# EAGLE design buttonbox (EAGLE 7.6.0)
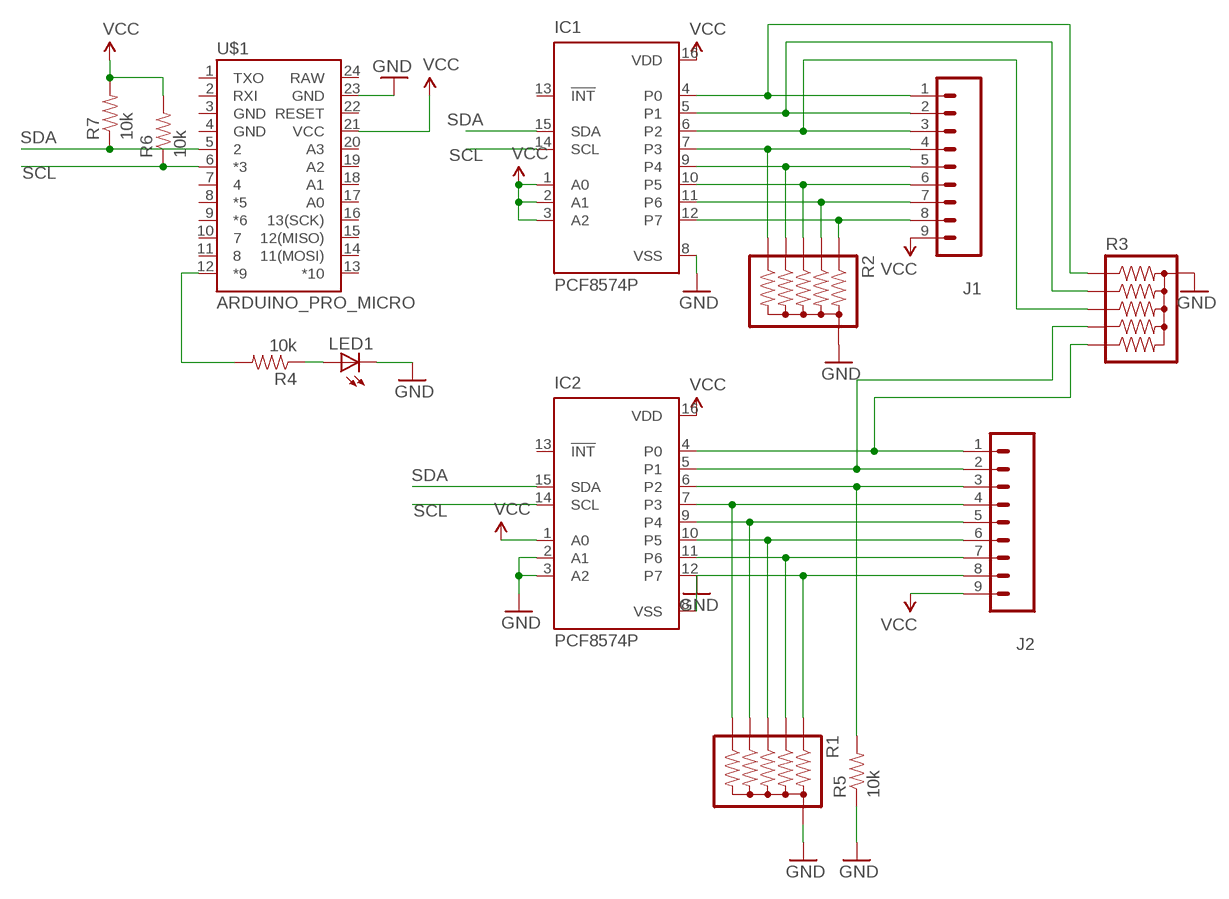
[diagram p0: schematic, sheet 1]

## Parts
IC1  PCF8574P  [DIL16]
IC2  PCF8574P  [DIL16]
J1  M09LONGPADS  [1X09_LONGPADS]
J2  M09LONGPADS  [1X09_LONGPADS]
LED1  LED5MM  [LED5MM]
R1  RPACK-BUSSED-5-SIP-PTH-5  [RPACK-SIP-PTH-5]
R2  RPACK-BUSSED-5-SIP-PTH-5  [RPACK-SIP-PTH-5]
R3  RPACK-BUSSED-5-SIP-PTH-5  [RPACK-SIP-PTH-5]
R4  10k  10KOHM-1/4W-1%(PTH)HORIZ  [AXIAL-0.3]
R5  10k  10KOHM-1/4W-1%(PTH)HORIZ  [AXIAL-0.3]
R6  10k  10KOHM-1/4W-1%(PTH)HORIZ  [AXIAL-0.3]
R7  10k  10KOHM-1/4W-1%(PTH)HORIZ  [AXIAL-0.3]
U$1  ARDUINO_PRO_MICRO  [ARDUINO_PRO_MICRO]

## Nets
GND: IC1.8(VSS) IC2.2(A1) IC2.3(A2) IC2.8(VSS) LED1.K(C) R1.P$1 R2.P$1 R3.P$1 R5.P$1 U$1.23(GND)
N$1: LED1.A R4.P$1
N$2: IC2.5(P1) J2.2 R3.P$5
N$5: R4.P$2 U$1.12(*9)
N$8: IC2.4(P0) J2.1 R3.P$6
N$10: IC2.6(P2) J2.3 R5.P$2
N$11: IC2.7(P3) J2.4 R1.P$6
N$12: IC2.9(P4) J2.5 R1.P$5
N$13: IC2.10(P5) J2.6 R1.P$4
N$14: IC2.11(P6) J2.7 R1.P$3
N$15: IC2.12(P7) J2.8 R1.P$2
N$16: IC1.4(P0) J1.1 R3.P$2
N$17: IC1.5(P1) J1.2 R3.P$3
N$18: IC1.6(P2) J1.3 R3.P$4
N$19: IC1.7(P3) J1.4 R2.P$6
N$20: IC1.9(P4) J1.5 R2.P$5
N$21: IC1.10(P5) J1.6 R2.P$4
N$22: IC1.11(P6) J1.7 R2.P$3
N$23: IC1.12(P7) J1.8 R2.P$2
SCL: IC1.14(SCL) IC2.14(SCL) R6.P$1 U$1.6(*3)
SDA: IC1.15(SDA) IC2.15(SDA) R7.P$1 U$1.5
VCC: IC1.1(A0) IC1.2(A1) IC1.3(A2) IC1.16(VDD) IC2.1(A0) IC2.16(VDD) J1.9 J2.9 R6.P$2 R7.P$2 U$1.21(VCC)
Unconnected: IC1.13(!INT) IC2.13(!INT) U$1.1(TXO) U$1.2(RXI) U$1.3(GND) U$1.4(GND) U$1.7 U$1.8(*5) U$1.9(*6) U$1.10 U$1.11 U$1.13(*10) U$1.14(11(MOSI)) U$1.15(12(MISO)) U$1.16(13(SCK)) U$1.17(A0) U$1.18(A1) U$1.19(A2) U$1.20(A3) U$1.22(RESET) U$1.24(RAW)

## Library data of the parts
IC1 IC2 = micro-philips:PCF8574: I2C-Bus Remote 8-bit I/O expander http://www.semiconductors.philips.com/acrobat_download/datasheets/PCF8574_4.pdf; MPN: PCF8574PN; OC_FARNELL: 204020; OC_NEWARK: 11N8515
J1 J2 = SparkFun-Connectors:M09: Header 9 Standard 9-pin 0.1" header. Use with straight break away headers (SKU : PRT-00116), right angle break away headers (PRT-00553), swiss pins (PRT-00743), machine pins (PRT-00117), and female headers (PRT-00115).
LED1 = adafruit:LED: LED OSRAM: - CHIPLED LG R971, LG N971, LY N971, LG Q971, LY Q971, LO R971, LY R971 LH N974, LH R974 LS Q976, LO Q976, LY Q976 LO Q996 - Hyper CHIPLED LW Q18S LB Q993, LB Q99A, LB R99A - SideLED LS A670, LO A670, LY A670, LG A670, LP A670 LB A673, LV A673, LT A673, LW A673 LH A674 LY A675 LS A676, LA A676, LO A676, LY A676, LW A676 LS A679, LY A679, LG A679 - Hyper Micro SIDELED® LS Y876, LA Y876, LO Y876, LY Y876 LT Y87S - SmartLED LW L88C, LW L88S LB L89C, LB L89S, LG L890 LS L89K, LO L89K, LY L89K LS L896, LA L896, LO L896, LY L896 - TOPLED LS T670, LO T670, LY T670, LG T670, LP T670 LSG T670, LSP T670, LSY T670, LOP T670, LYG T670 LG T671, LOG T671, LSG T671 LB T673, LV T673, LT T673, LW T673 LH T674 LS T676, LA T676, LO T676, LY T676, LB T676, LH T676, LSB T676, LW T676 LB T67C, LV T67C, LT T67C, LS T67K, LO T67K, LY T67K, LW E67C LS E67B, LA E67B, LO E67B, LY E67B, LB E67C, LV E67C, LT E67C LW T67C LS T679, LY T679, LG T679 LS T770, LO T770, LY T770, LG T770, LP T770 LB T773, LV T773, LT T773, LW T773 LH T774 LS E675, LA E675, LY E675, LS T675 LS T776, LA T776, LO T776, LY T776, LB T776 LHGB T686 LT T68C, LB T68C - Hyper Mini TOPLED® LB M676 - Mini TOPLED Santana® LG M470 LS M47K, LO M47K, LY M47K Source: http://www.osram.convergy.de/
R1-R3 = SparkFun-Resistors:RPACK-BUSSED-5: BOURNS 4600X series thick-film SIP resistor packs Five resistors bussed to a single pin (denoted by dot). 0.2W / resistor datasheet <http://dlnmh9ip6v2uc.cloudfront.net/datasheets/Components/General/4600x.pdf> SFE parts COM-10855 (330), COM-10856 (10K)
R4-R7 = SparkFun-Resistors:10KOHM-1/4W-1%(PTH): RES-12183; PROD_ID: RES-12183
U$1 = SparkFun-Boards:ARDUINO_PRO_MICRO

## Board
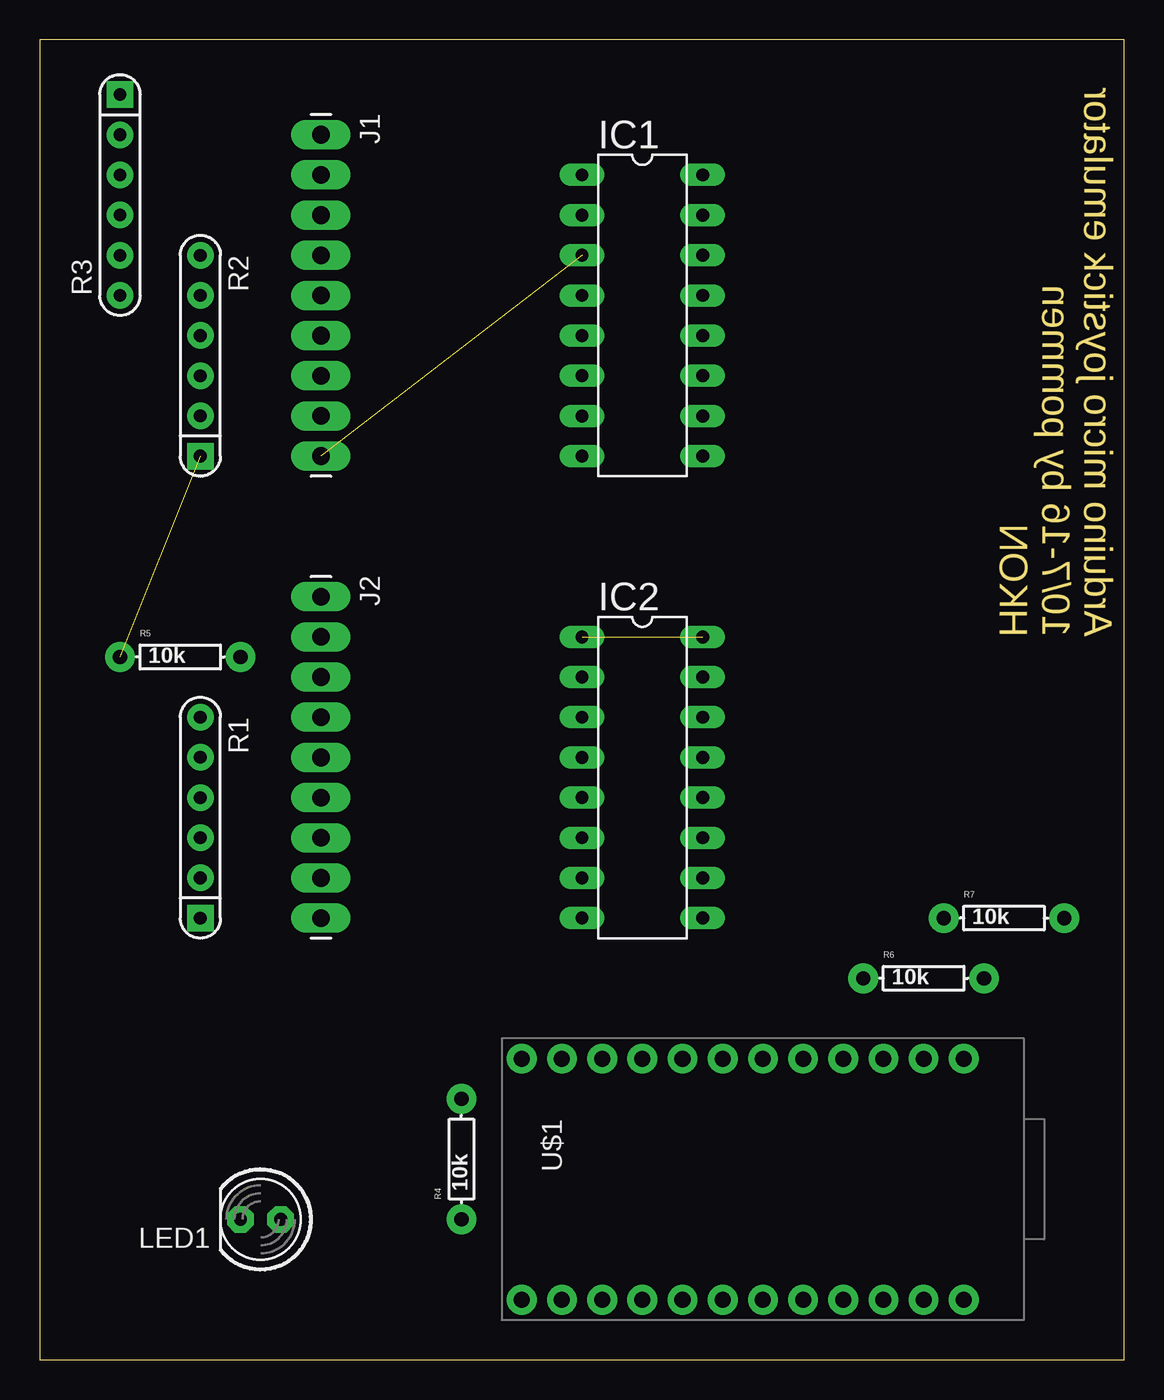
[diagram p1: board, top side]
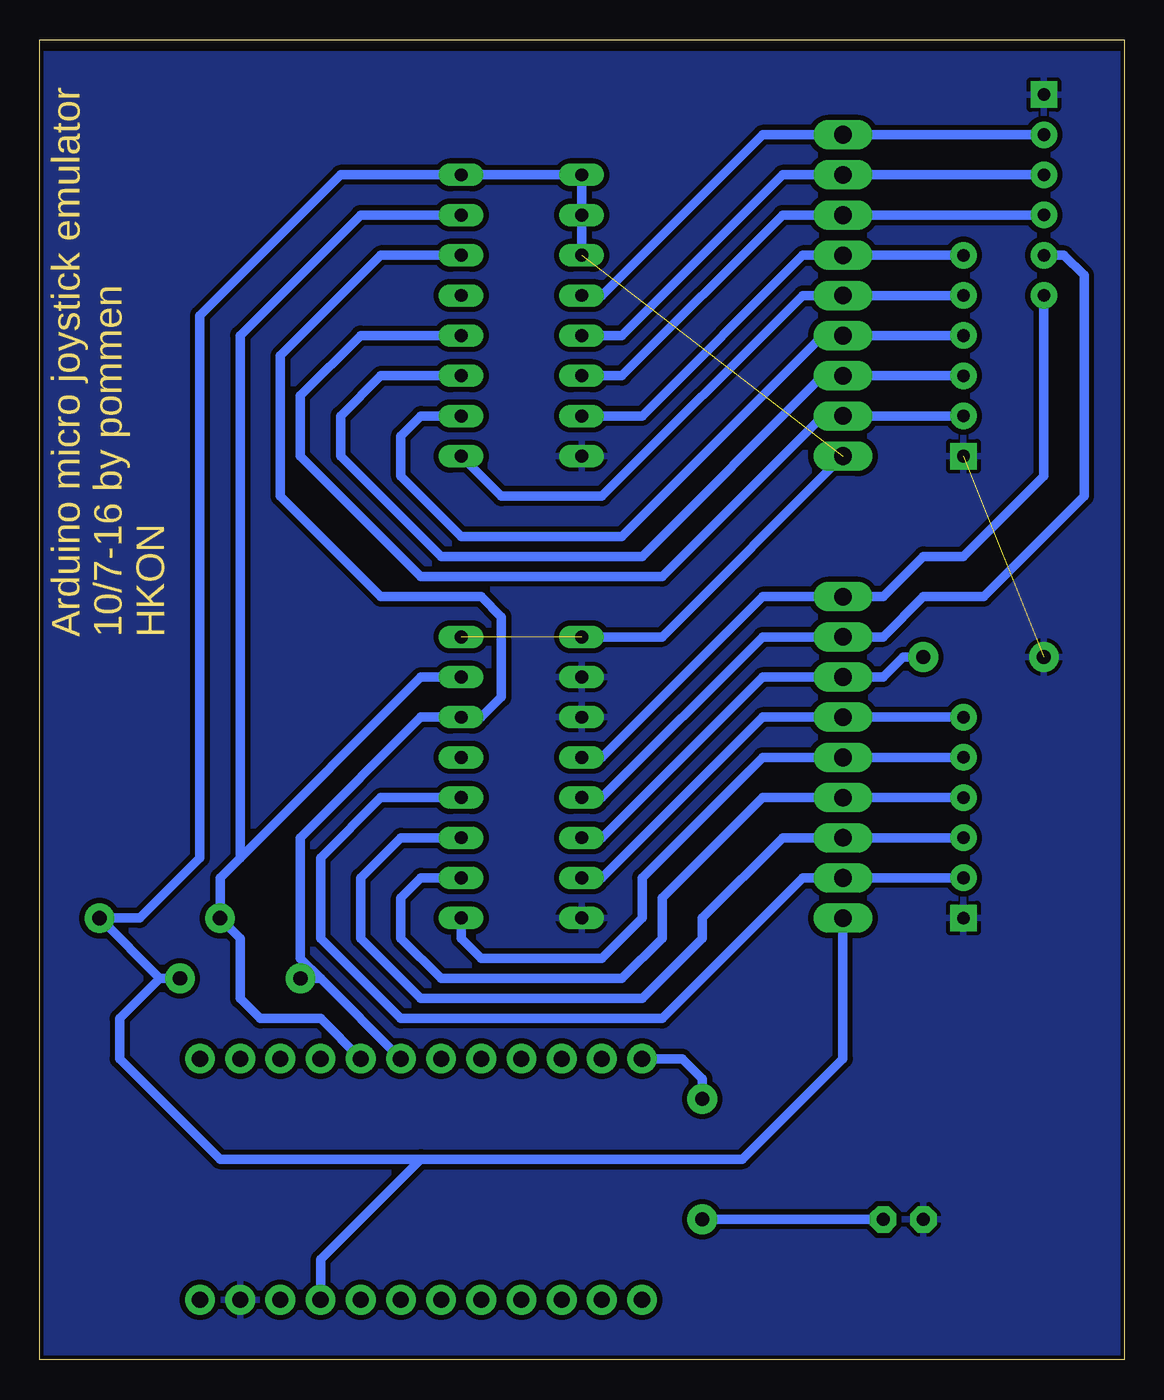
[diagram p2: board, bottom side, seen from below]

Size 68.56 x 83.49 mm. Coordinates in mm from the lower left corner, seen from the top.
Outline: 0,0 68.56,0 68.56,83.49 0,83.49 0,0
Copper layers (1*16): Top 0.035mm / dielectric 1.5mm / Bottom 0.035mm
Design rules "Peters": minimum track width 8mil, minimum drill 20mil, track to track 13mil, track to pad 13mil, pad to pad 13mil, via to via 13mil, smd to smd 13mil, copper to edge 10mil, drill to drill 8mil, minimum pad ring 12mil, minimum via ring 10mil, stop-mask expansion 4mil, vias tented up to drill 25mil, thermal gap 10mil

### Footprints (pad centres in the part's own frame; a part is rotated, then mirrored left to right if it is on the bottom)
DIL16 = drill 0.813 long: 1 -8.89,-3.81; 2 -6.35,-3.81; 3 -3.81,-3.81; 4 -1.27,-3.81; 5 1.27,-3.81; 6 3.81,-3.81; 7 6.35,-3.81; 8 8.89,-3.81; 9 8.89,3.81; 10 6.35,3.81; 11 3.81,3.81; 12 1.27,3.81; 13 -1.27,3.81; 14 -3.81,3.81; 15 -6.35,3.81; 16 -8.89,3.81
1X09_LONGPADS = drill 1.118 pad 1.88 long: 1 0,0; 2 2.54,0; 3 5.08,0; 4 7.62,0; 5 10.16,0; 6 12.7,0; 7 15.24,0; 8 17.78,0; 9 20.32,0
LED5MM = drill 0.813 pad 1.676 octagon: A -1.27,0; K 1.27,0
RPACK-SIP-PTH-5 = drill 0.8 pad 1.676 square: P$1 0,0 | drill 0.8 pad 1.676: P$2 0,-2.54; P$3 0,-5.08; P$4 0,-7.62; P$5 0,-10.16; P$6 0,-12.7
AXIAL-0.3 = drill 0.9 pad 1.88: P$1 -3.81,0; P$2 3.81,0
ARDUINO_PRO_MICRO = drill 1.016 pad 1.88: 1 -7.62,12.7; 2 -7.62,10.16; 3 -7.62,7.62; 4 -7.62,5.08; 5 -7.62,2.54; 6 -7.62,0; 7 -7.62,-2.54; 8 -7.62,-5.08; 9 -7.62,-7.62; 10 -7.62,-10.16; 11 -7.62,-12.7; 12 -7.62,-15.24; 13 7.62,-15.24; 14 7.62,-12.7; 15 7.62,-10.16; 16 7.62,-7.62; 17 7.62,-5.08; 18 7.62,-2.54; 19 7.62,0; 20 7.62,2.54; 21 7.62,5.08; 22 7.62,7.62; 23 7.62,10.16; 24 7.62,12.7

### Placement (x,y rotation side)
IC1  38.1,66.04 270 top
IC2  38.1,36.83 270 top
J1  17.78,77.47 270 top
J2  17.78,48.26 270 top
LED1  13.97,8.89 180 top
R1  10.16,27.94 180 top
R2  10.16,57.15 180 top
R3  5.08,80.01 0 top
R4  26.67,12.7 90 top
R5  8.89,44.45 0 top
R6  55.88,24.13 0 top
R7  60.96,27.94 0 top
U$1  45.72,11.43 270 top

### Tracks (layer width: path | path; a pad name or v marks a point on that pad's centre or on a via)
GND  (1 unrouted)
  pour Bottom: 0,0 0,82.55 68.58,82.55 68.58,0
N$1
  Bottom 0.61: LED1.A R4.P$1
N$2
  Bottom 0.61: IC2.5 33.02,35.56 22.86,45.72 J2.2 15.24,45.72 12.7,48.26 8.89,48.26 2.54,54.61 2.54,68.58 3.81,69.85 R3.P$5
N$5
  Bottom 0.61: R4.P$2 26.67,17.78 27.94,19.05 U$1.12
N$8
  Bottom 0.61: IC2.4 33.02,38.1 22.86,48.26 J2.1 15.24,48.26 12.7,50.8 10.16,50.8 5.08,55.88 R3.P$6
N$10
  Bottom 0.61: R5.P$2 13.97,44.45 15.24,43.18 J2.3 22.86,43.18 33.02,33.02 IC2.6
N$11
  Bottom 0.61: R1.P$6 J2.4 22.86,40.64 33.02,30.48 IC2.7
N$12
  Bottom 0.61: R1.P$5 J2.5 22.86,38.1 30.48,30.48 30.48,27.94 33.02,25.4 40.64,25.4 41.91,26.67 IC2.9
N$13
  Bottom 0.61: R1.P$4 J2.6 22.86,35.56 29.21,29.21 29.21,26.67 31.75,24.13 43.18,24.13 45.72,26.67 45.72,29.21 44.45,30.48 IC2.10
N$14
  Bottom 0.61: R1.P$3 J2.7 21.59,33.02 26.67,27.94 26.67,26.67 30.48,22.86 44.45,22.86 48.26,26.67 48.26,30.48 45.72,33.02 IC2.11
N$15
  Bottom 0.61: R1.P$2 J2.8 20.32,30.48 29.21,21.59 45.72,21.59 50.8,26.67 50.8,31.75 46.99,35.56 IC2.12
N$16
  Bottom 0.61: IC1.4 33.02,67.31 22.86,77.47 J1.1 R3.P$2
N$17
  Bottom 0.61: IC1.5 31.75,64.77 21.59,74.93 J1.2 R3.P$3
N$18
  Bottom 0.61: IC1.6 31.75,62.23 21.59,72.39 J1.3 R3.P$4
N$19
  Bottom 0.61: R2.P$6 J1.4 20.32,69.85 30.48,59.69 IC1.7
N$20
  Bottom 0.61: R2.P$5 J1.5 20.32,67.31 33.02,54.61 39.37,54.61 IC1.9
N$21
  Bottom 0.61: R2.P$4 J1.6 19.05,64.77 31.75,52.07 41.91,52.07 45.72,55.88 45.72,58.42 44.45,59.69 IC1.10
N$22
  Bottom 0.61: R2.P$3 J1.7 19.05,62.23 30.48,50.8 43.18,50.8 49.53,57.15 49.53,59.69 46.99,62.23 IC1.11
N$23
  Bottom 0.61: R2.P$2 J1.8 19.05,59.69 29.21,49.53 44.45,49.53 52.07,57.15 52.07,60.96 48.26,64.77 IC1.12
SCL
  Bottom 0.61: U$1.6 50.8,24.13 | 50.8,24.13 R6.P$1 | 50.8,24.13 52.07,25.4 52.07,33.02 44.45,40.64 IC2.14 40.64,40.64 39.37,41.91 39.37,46.99 40.64,48.26 46.99,48.26 53.34,54.61 53.34,63.5 46.99,69.85 IC1.14
SDA
  Bottom 0.61: U$1.5 50.8,21.59 54.61,21.59 55.88,22.86 55.88,26.67 R7.P$1 57.15,30.48 55.88,31.75 | 55.88,31.75 44.45,43.18 IC2.15 | IC1.15 48.26,72.39 55.88,64.77 55.88,31.75
VCC  (2 unrouted)
  Bottom 0.61: U$1.21 50.8,6.35 44.45,12.7 | 44.45,12.7 24.13,12.7 17.78,19.05 J2.9 | IC1.3 IC1.2 IC1.1 IC1.16 49.53,74.93 58.42,66.04 58.42,31.75 62.23,27.94 R7.P$2 60.96,24.13 | R6.P$2 60.96,24.13 | 60.96,24.13 63.5,21.59 63.5,19.05 57.15,12.7 44.45,12.7 | IC2.1 29.21,45.72 J1.9

### Text on the board
Milling: Arduino micro joystick emulator / 10/7-16 by pommen / HKON